# Altium schematic sheet 7Seg.SchDoc
size A4
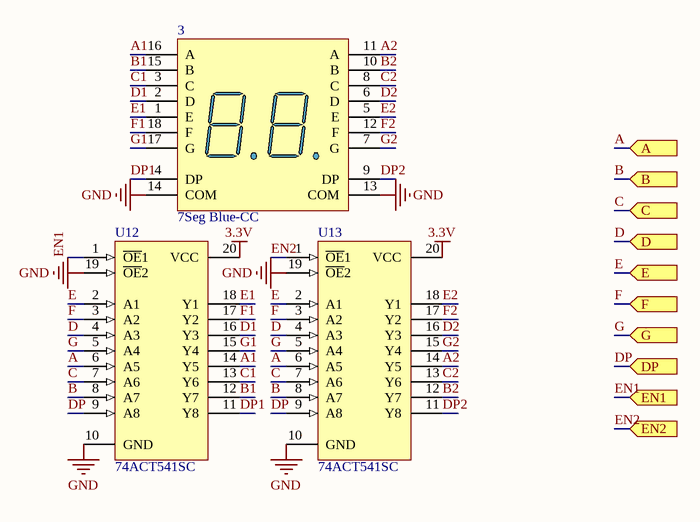
[diagram p0: 7Seg.SchDoc]

## Parts
3  7Seg Blue-CC  [7Segment Dual]
U12  74ACT541SC  [M20B_N]
U13  74ACT541SC  [M20B_N]

## Ports
A (in), B (in), C (in), D (in), DP (in), E (in), EN1 (in), EN2 (in), F (in), G (in)

## Nets
3.3V: U12.20(VCC) U13.20(VCC)
GND: 3.13(COM) 3.14(COM) U12.10(GND) U12.19(~{OE}2) U13.10(GND) U13.19(~{OE}2)
A: U12.6(A5) U13.6(A5) ; port A
A1: 3.16(A) U12.14(Y5)
A2: 3.11(A) U13.14(Y5)
B: U12.8(A7) U13.8(A7) ; port B
B1: 3.15(B) U12.12(Y7)
B2: 3.10(B) U13.12(Y7)
C: U12.7(A6) U13.7(A6) ; port C
C1: 3.3(C) U12.13(Y6)
C2: 3.8(C) U13.13(Y6)
D: U12.4(A3) U13.4(A3) ; port D
D1: 3.2(D) U12.16(Y3)
D2: 3.6(D) U13.16(Y3)
DP: U12.9(A8) U13.9(A8) ; port DP
DP1: 3.4(DP) U12.11(Y8)
DP2: 3.9(DP) U13.11(Y8)
E: U12.2(A1) U13.2(A1) ; port E
E1: 3.1(E) U12.18(Y1)
E2: 3.5(E) U13.18(Y1)
EN1: U12.1(~{OE}1) ; port EN1
EN2: U13.1(~{OE}1) ; port EN2
F: U12.3(A2) U13.3(A2) ; port F
F1: 3.18(F) U12.17(Y2)
F2: 3.12(F) U13.17(Y2)
G: U12.5(A4) U13.5(A4) ; port G
G1: 3.17(G) U12.15(Y4)
G2: 3.7(G) U13.15(Y4)

## Library data of the parts
3 = 7Seg Blue-CC_Dual: General Purpose Blue 7-Segment Display: CC, RH DP, Gray Surface; MinimumIntensity: 2020 ucd; Note: IF = 10 mA; Published: 8-Jun-2000; LatestRevisionDate: 17-Dec-2003; LatestRevisionNote: Schematic revised, PCB Footprint replaced.; DatasheetDocument: 24-Sep-2002; PackageDocument: 24-Sep-2002; PackageReference: H; Publisher: Altium Limited; Colour: Blue; ComponentLink1Description: Manufacturer Link; ComponentLink1URL: http://www.agilent.com/
U12 U13 = 74ACT541SC: Octal Buffer/Line Driver with 3-State Output; Published: 17-Jul-2002; LatestRevisionDate: 13-Apr-2006; LatestRevisionNote: IPC-7351 Footprint Added.; DatasheetVersion: Oct-1999; PackageVersion: 2000; PackageReference: M20B; Publisher: Altium Limited; PackageDescription: 20-Pin Small Outline Integrated Circuit 1.27 mm Pitch; Code_JEDEC: MS-013-AC; Code_IPC: SOIC127P1030-20; ComponentLink1Description: Manufacturer Link; ComponentLink1URL: http://www.fairchildsemi.com/; ComponentLink2Description: Datasheet; ComponentLink2URL: http://www.fairchildsemi.com/ds/74%2F74AC541.pdf